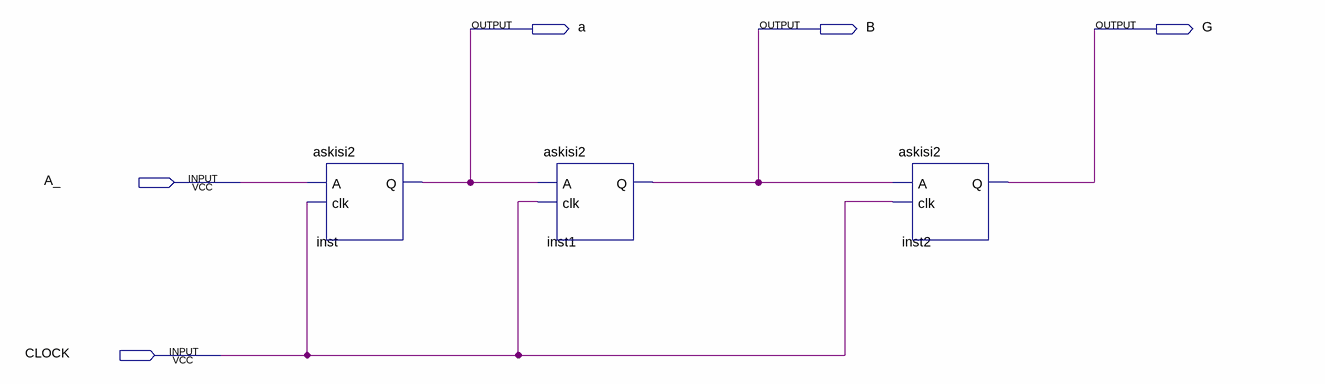
[diagram p0: schematic sheet]
// Quartus schematic Block1.bdf as structural Verilog: 3 symbols, 5 pins
module Block1 (
  input  A_,
  input  CLOCK,
  output a,
  output B,
  output G
);

  askisi2 inst (.A(A_), .clk(CLOCK), .Q(a));
  askisi2 inst1 (.A(a), .clk(CLOCK), .Q(B));
  askisi2 inst2 (.A(B), .clk(CLOCK), .Q(G));
endmodule
